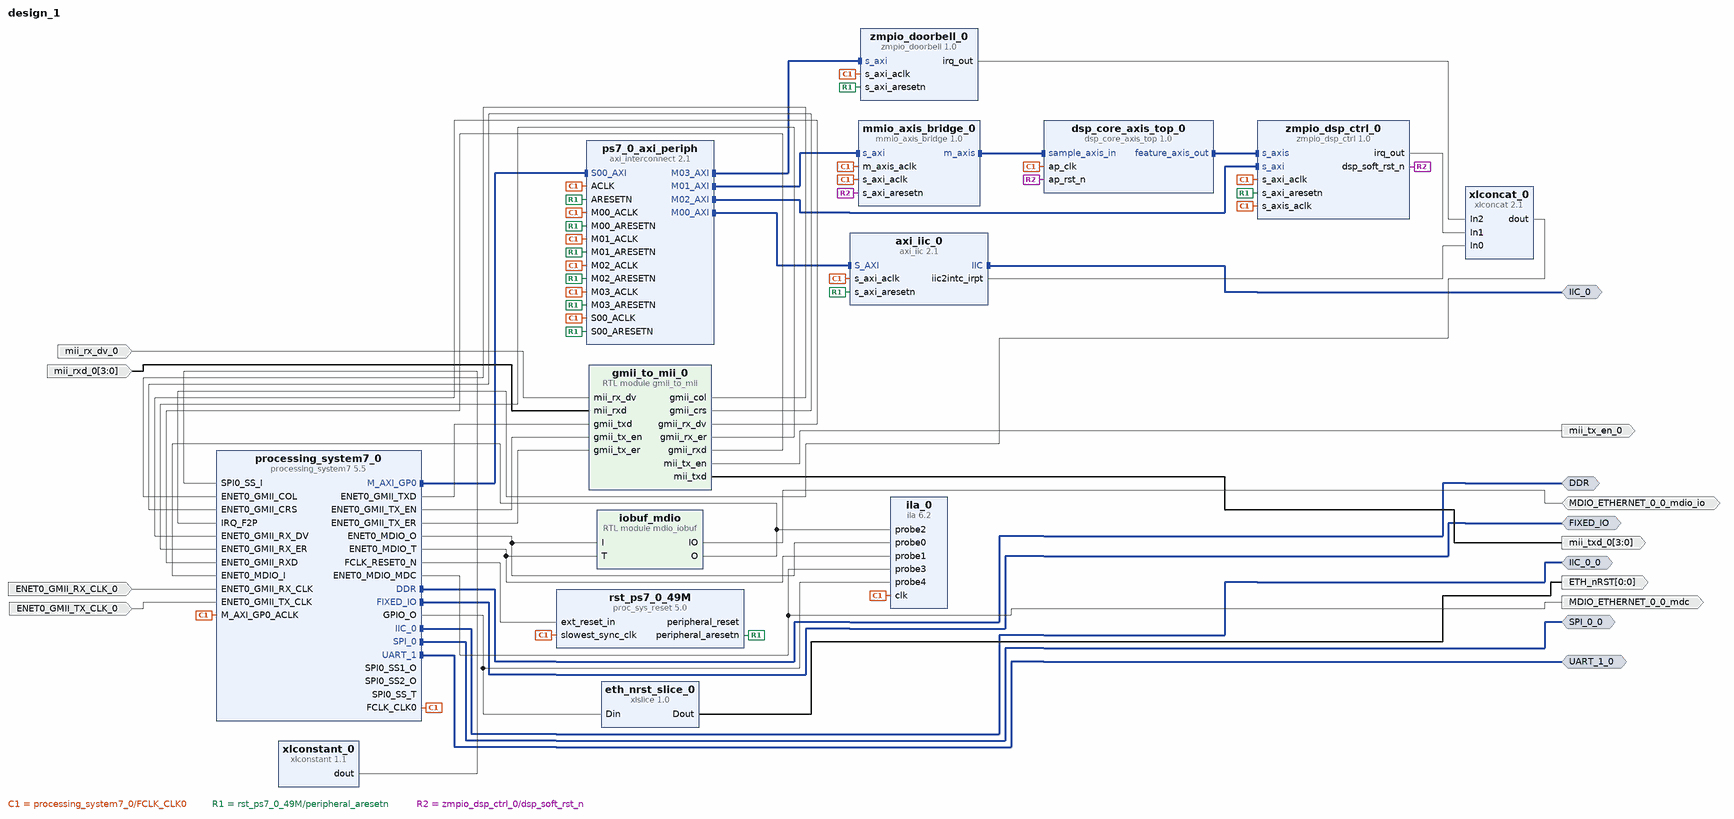
[diagram p0: block diagram of the top level]
# Vivado block design design_1, xc7z020clg400-2, Vivado 2023.2
create_bd_design design_1

create_bd_intf_port -mode Master -vlnv xilinx.com:interface:ddrx_rtl:1.0 DDR
create_bd_intf_port -mode Master -vlnv xilinx.com:display_processing_system7:fixedio_rtl:1.0 FIXED_IO
create_bd_intf_port -mode Master -vlnv xilinx.com:interface:spi_rtl:1.0 SPI_0_0
create_bd_intf_port -mode Master -vlnv xilinx.com:interface:iic_rtl:1.0 IIC_0
create_bd_intf_port -mode Master -vlnv xilinx.com:interface:iic_rtl:1.0 IIC_0_0
create_bd_intf_port -mode Master -vlnv xilinx.com:interface:uart_rtl:1.0 UART_1_0
create_bd_port -dir I -from 3 -to 0 mii_rxd_0
create_bd_port -dir I mii_rx_dv_0
create_bd_port -dir O -from 3 -to 0 mii_txd_0
create_bd_port -dir O mii_tx_en_0
create_bd_port -dir I -type clk ENET0_GMII_RX_CLK_0
create_bd_port -dir I -type clk ENET0_GMII_TX_CLK_0
create_bd_port -dir IO MDIO_ETHERNET_0_0_mdio_io
create_bd_port -dir O MDIO_ETHERNET_0_0_mdc
create_bd_port -dir O -from 0 -to 0 ETH_nRST

create_bd_cell -type ip -vlnv xilinx.com:ip:processing_system7:5.5 processing_system7_0
set_property -dict [list \
  CONFIG.PCW_APU_PERIPHERAL_FREQMHZ 533.333333 \
  CONFIG.PCW_CPU_CPU_6X4X_MAX_RANGE 767 \
  CONFIG.PCW_CRYSTAL_PERIPHERAL_FREQMHZ 33.33 \
  CONFIG.PCW_ENET0_ENET0_IO EMIO \
  CONFIG.PCW_ENET0_GRP_MDIO_ENABLE 1 \
  CONFIG.PCW_ENET0_GRP_MDIO_IO EMIO \
  CONFIG.PCW_ENET0_PERIPHERAL_ENABLE 1 \
  CONFIG.PCW_ENET0_RESET_ENABLE 0 \
  CONFIG.PCW_ENET_RESET_ENABLE 1 \
  CONFIG.PCW_ENET_RESET_SELECT {Share reset pin} \
  CONFIG.PCW_FPGA0_PERIPHERAL_FREQMHZ 50 \
  CONFIG.PCW_FPGA1_PERIPHERAL_FREQMHZ 200 \
  CONFIG.PCW_GPIO_EMIO_GPIO_ENABLE 1 \
  CONFIG.PCW_GPIO_EMIO_GPIO_IO MIO \
  CONFIG.PCW_GPIO_MIO_GPIO_ENABLE 1 \
  CONFIG.PCW_GPIO_MIO_GPIO_IO MIO \
  CONFIG.PCW_I2C0_I2C0_IO EMIO \
  CONFIG.PCW_I2C0_PERIPHERAL_ENABLE 1 \
  CONFIG.PCW_I2C_PERIPHERAL_FREQMHZ 88.879997 \
  CONFIG.PCW_I2C_RESET_ENABLE 1 \
  CONFIG.PCW_I2C_RESET_SELECT {Share reset pin} \
  CONFIG.PCW_IRQ_F2P_INTR 1 \
  CONFIG.PCW_PERIPHERAL_BOARD_PRESET None \
  CONFIG.PCW_PRESET_BANK1_VOLTAGE {LVCMOS 3.3V} \
  CONFIG.PCW_QSPI_PERIPHERAL_ENABLE 0 \
  CONFIG.PCW_SD0_GRP_CD_ENABLE 0 \
  CONFIG.PCW_SD0_GRP_WP_ENABLE 0 \
  CONFIG.PCW_SD0_PERIPHERAL_ENABLE 1 \
  CONFIG.PCW_SD0_SD0_IO {MIO 40 .. 45} \
  CONFIG.PCW_SDIO_PERIPHERAL_FREQMHZ 100 \
  CONFIG.PCW_SPI0_PERIPHERAL_ENABLE 1 \
  CONFIG.PCW_SPI0_SPI0_IO EMIO \
  CONFIG.PCW_SPI_PERIPHERAL_FREQMHZ 100 \
  CONFIG.PCW_TTC0_PERIPHERAL_ENABLE 1 \
  CONFIG.PCW_TTC0_TTC0_IO EMIO \
  CONFIG.PCW_UART0_PERIPHERAL_ENABLE 1 \
  CONFIG.PCW_UART0_UART0_IO {MIO 14 .. 15} \
  CONFIG.PCW_UART1_PERIPHERAL_ENABLE 1 \
  CONFIG.PCW_UART1_UART1_IO EMIO \
  CONFIG.PCW_UART_PERIPHERAL_FREQMHZ 100 \
  CONFIG.PCW_UIPARAM_DDR_BUS_WIDTH {16 Bit} \
  CONFIG.PCW_UIPARAM_DDR_FREQ_MHZ 533.333333 \
  CONFIG.PCW_UIPARAM_DDR_PARTNO {MT41J256M16 RE-125} \
  CONFIG.PCW_USB0_PERIPHERAL_ENABLE 0 \
  CONFIG.PCW_USB_RESET_ENABLE 1 \
  CONFIG.PCW_USE_FABRIC_INTERRUPT 1 \
  CONFIG.preset None \
] [get_bd_cells processing_system7_0]
# 516 more settings of processing_system7_0 are not shown: defaults, MIO pin electricals, DDR timing, and values the tool derives
create_bd_cell -type ip -vlnv xilinx.com:ip:axi_iic:2.1 axi_iic_0
create_bd_cell -type ip -vlnv xilinx.com:ip:axi_interconnect:2.1 ps7_0_axi_periph
set_property -dict {CONFIG.NUM_MI 4} [get_bd_cells ps7_0_axi_periph]
create_bd_cell -type ip -vlnv xilinx.com:ip:proc_sys_reset:5.0 rst_ps7_0_49M
create_bd_cell -type ip -vlnv xilinx.com:ip:xlconstant:1.1 xlconstant_0
create_bd_cell -type module -reference gmii_to_mii gmii_to_mii_0
create_bd_cell -type ip -vlnv xilinx.com:ip:ila:6.2 ila_0
set_property -dict [list \
  CONFIG.C_ADV_TRIGGER false \
  CONFIG.C_DATA_DEPTH 1024 \
  CONFIG.C_EN_STRG_QUAL 0 \
  CONFIG.C_NUM_OF_PROBES 5 \
  CONFIG.C_PROBE0_WIDTH 1 \
  CONFIG.C_PROBE1_WIDTH 1 \
  CONFIG.C_PROBE2_WIDTH 1 \
  CONFIG.C_PROBE3_WIDTH 1 \
  CONFIG.C_PROBE4_WIDTH 1 \
] [get_bd_cells ila_0]
create_bd_cell -type module -reference mdio_iobuf iobuf_mdio
create_bd_cell -type ip -vlnv zmpio:dsp_core:dsp_core_axis_top:1.0 dsp_core_axis_top_0
create_bd_cell -type ip -vlnv xilinx.com:ip:xlslice:1.0 eth_nrst_slice_0
set_property -dict {CONFIG.DIN_FROM 0 CONFIG.DIN_TO 0 CONFIG.DIN_WIDTH 64 CONFIG.DOUT_WIDTH 1} [get_bd_cells eth_nrst_slice_0]
create_bd_cell -type ip -vlnv zmpio:user:mmio_axis_bridge:1.0 mmio_axis_bridge_0
create_bd_cell -type ip -vlnv zmpio:user:zmpio_dsp_ctrl:1.0 zmpio_dsp_ctrl_0
create_bd_cell -type ip -vlnv zmpio:user:zmpio_doorbell:1.0 zmpio_doorbell_0
create_bd_cell -type ip -vlnv xilinx.com:ip:xlconcat:2.1 xlconcat_0
set_property -dict {CONFIG.NUM_PORTS 3} [get_bd_cells xlconcat_0]

# ---- connections ----

connect_bd_intf_net [get_bd_intf_ports IIC_0] [get_bd_intf_pins axi_iic_0/IIC]
connect_bd_intf_net [get_bd_intf_pins dsp_core_axis_top_0/feature_axis_out] [get_bd_intf_pins zmpio_dsp_ctrl_0/s_axis]
connect_bd_intf_net [get_bd_intf_pins mmio_axis_bridge_0/m_axis] [get_bd_intf_pins dsp_core_axis_top_0/sample_axis_in]
connect_bd_intf_net [get_bd_intf_ports DDR] [get_bd_intf_pins processing_system7_0/DDR]
connect_bd_intf_net [get_bd_intf_ports FIXED_IO] [get_bd_intf_pins processing_system7_0/FIXED_IO]
connect_bd_intf_net [get_bd_intf_ports IIC_0_0] [get_bd_intf_pins processing_system7_0/IIC_0]
connect_bd_intf_net [get_bd_intf_pins processing_system7_0/M_AXI_GP0] [get_bd_intf_pins ps7_0_axi_periph/S00_AXI]
connect_bd_intf_net [get_bd_intf_ports SPI_0_0] [get_bd_intf_pins processing_system7_0/SPI_0]
connect_bd_intf_net [get_bd_intf_ports UART_1_0] [get_bd_intf_pins processing_system7_0/UART_1]
connect_bd_intf_net [get_bd_intf_pins ps7_0_axi_periph/M00_AXI] [get_bd_intf_pins axi_iic_0/S_AXI]
connect_bd_intf_net [get_bd_intf_pins ps7_0_axi_periph/M01_AXI] [get_bd_intf_pins mmio_axis_bridge_0/s_axi]
connect_bd_intf_net [get_bd_intf_pins ps7_0_axi_periph/M02_AXI] [get_bd_intf_pins zmpio_dsp_ctrl_0/s_axi]
connect_bd_intf_net [get_bd_intf_pins ps7_0_axi_periph/M03_AXI] [get_bd_intf_pins zmpio_doorbell_0/s_axi]
connect_bd_net -net ENET0_GMII_RX_CLK_0_1 [get_bd_ports ENET0_GMII_RX_CLK_0] [get_bd_pins processing_system7_0/ENET0_GMII_RX_CLK]
connect_bd_net -net ENET0_GMII_TX_CLK_0_1 [get_bd_ports ENET0_GMII_TX_CLK_0] [get_bd_pins processing_system7_0/ENET0_GMII_TX_CLK]
# net Net has one end: 
connect_bd_net [get_bd_ports MDIO_ETHERNET_0_0_mdio_io] [get_bd_pins iobuf_mdio/IO]
connect_bd_net [get_bd_pins axi_iic_0/iic2intc_irpt] [get_bd_pins xlconcat_0/In0]
connect_bd_net [get_bd_pins eth_nrst_slice_0/Dout] [get_bd_ports ETH_nRST]
connect_bd_net [get_bd_pins gmii_to_mii_0/gmii_col] [get_bd_pins processing_system7_0/ENET0_GMII_COL]
connect_bd_net [get_bd_pins gmii_to_mii_0/gmii_crs] [get_bd_pins processing_system7_0/ENET0_GMII_CRS]
connect_bd_net [get_bd_pins gmii_to_mii_0/gmii_rx_dv] [get_bd_pins processing_system7_0/ENET0_GMII_RX_DV]
connect_bd_net [get_bd_pins gmii_to_mii_0/gmii_rx_er] [get_bd_pins processing_system7_0/ENET0_GMII_RX_ER]
connect_bd_net [get_bd_pins gmii_to_mii_0/gmii_rxd] [get_bd_pins processing_system7_0/ENET0_GMII_RXD]
connect_bd_net [get_bd_pins gmii_to_mii_0/mii_tx_en] [get_bd_ports mii_tx_en_0]
connect_bd_net [get_bd_pins gmii_to_mii_0/mii_txd] [get_bd_ports mii_txd_0]
connect_bd_net [get_bd_pins iobuf_mdio/O] [get_bd_pins processing_system7_0/ENET0_MDIO_I] [get_bd_pins ila_0/probe2]
connect_bd_net -net mii_rx_dv_0_1 [get_bd_ports mii_rx_dv_0] [get_bd_pins gmii_to_mii_0/mii_rx_dv]
connect_bd_net -net mii_rxd_0_1 [get_bd_ports mii_rxd_0] [get_bd_pins gmii_to_mii_0/mii_rxd]
connect_bd_net [get_bd_pins processing_system7_0/ENET0_GMII_TXD] [get_bd_pins gmii_to_mii_0/gmii_txd]
connect_bd_net [get_bd_pins processing_system7_0/ENET0_GMII_TX_EN] [get_bd_pins gmii_to_mii_0/gmii_tx_en]
connect_bd_net [get_bd_pins processing_system7_0/ENET0_GMII_TX_ER] [get_bd_pins gmii_to_mii_0/gmii_tx_er]
connect_bd_net -net processing_system7_0_ENET0_MDIO_MDC [get_bd_pins processing_system7_0/ENET0_MDIO_MDC] \
  [get_bd_pins ila_0/probe3] [get_bd_ports MDIO_ETHERNET_0_0_mdc]
connect_bd_net -net processing_system7_0_ENET0_MDIO_O [get_bd_pins processing_system7_0/ENET0_MDIO_O] \
  [get_bd_pins ila_0/probe0] [get_bd_pins iobuf_mdio/I]
connect_bd_net -net processing_system7_0_ENET0_MDIO_T [get_bd_pins processing_system7_0/ENET0_MDIO_T] \
  [get_bd_pins ila_0/probe1] [get_bd_pins iobuf_mdio/T]
connect_bd_net [get_bd_pins processing_system7_0/FCLK_CLK0] \
  [get_bd_pins processing_system7_0/M_AXI_GP0_ACLK] [get_bd_pins ps7_0_axi_periph/S00_ACLK] \
  [get_bd_pins rst_ps7_0_49M/slowest_sync_clk] [get_bd_pins ps7_0_axi_periph/M00_ACLK] [get_bd_pins ps7_0_axi_periph/ACLK] \
  [get_bd_pins axi_iic_0/s_axi_aclk] [get_bd_pins ila_0/clk] [get_bd_pins ps7_0_axi_periph/M01_ACLK] \
  [get_bd_pins ps7_0_axi_periph/M02_ACLK] [get_bd_pins mmio_axis_bridge_0/s_axi_aclk] \
  [get_bd_pins mmio_axis_bridge_0/m_axis_aclk] [get_bd_pins dsp_core_axis_top_0/ap_clk] \
  [get_bd_pins zmpio_dsp_ctrl_0/s_axi_aclk] [get_bd_pins zmpio_dsp_ctrl_0/s_axis_aclk] \
  [get_bd_pins zmpio_doorbell_0/s_axi_aclk] [get_bd_pins ps7_0_axi_periph/M03_ACLK]
connect_bd_net [get_bd_pins processing_system7_0/FCLK_RESET0_N] [get_bd_pins rst_ps7_0_49M/ext_reset_in]
connect_bd_net [get_bd_pins processing_system7_0/GPIO_O] [get_bd_pins eth_nrst_slice_0/Din] [get_bd_pins ila_0/probe4]
# net processing_system7_0_SPI0_SS1_O has one end: processing_system7_0/SPI0_SS1_O
# net processing_system7_0_SPI0_SS2_O has one end: processing_system7_0/SPI0_SS2_O
# net processing_system7_0_SPI0_SS_T has one end: processing_system7_0/SPI0_SS_T
connect_bd_net [get_bd_pins rst_ps7_0_49M/peripheral_aresetn] \
  [get_bd_pins ps7_0_axi_periph/S00_ARESETN] [get_bd_pins ps7_0_axi_periph/M00_ARESETN] \
  [get_bd_pins ps7_0_axi_periph/ARESETN] [get_bd_pins axi_iic_0/s_axi_aresetn] [get_bd_pins ps7_0_axi_periph/M01_ARESETN] \
  [get_bd_pins ps7_0_axi_periph/M02_ARESETN] [get_bd_pins zmpio_dsp_ctrl_0/s_axi_aresetn] \
  [get_bd_pins zmpio_doorbell_0/s_axi_aresetn] [get_bd_pins ps7_0_axi_periph/M03_ARESETN]
# net rst_ps7_0_49M_peripheral_reset has one end: rst_ps7_0_49M/peripheral_reset
connect_bd_net [get_bd_pins xlconcat_0/dout] [get_bd_pins processing_system7_0/IRQ_F2P]
connect_bd_net [get_bd_pins xlconstant_0/dout] [get_bd_pins processing_system7_0/SPI0_SS_I]
connect_bd_net [get_bd_pins zmpio_doorbell_0/irq_out] [get_bd_pins xlconcat_0/In2]
connect_bd_net [get_bd_pins zmpio_dsp_ctrl_0/dsp_soft_rst_n] [get_bd_pins dsp_core_axis_top_0/ap_rst_n] [get_bd_pins mmio_axis_bridge_0/s_axi_aresetn]
connect_bd_net [get_bd_pins zmpio_dsp_ctrl_0/irq_out] [get_bd_pins xlconcat_0/In1]
set_property HDL_ATTRIBUTE.DEBUG true [get_bd_nets Net]
set_property HDL_ATTRIBUTE.MARK_DEBUG true [get_bd_nets Net]
set_property HDL_ATTRIBUTE.DEBUG true [get_bd_nets processing_system7_0_ENET0_MDIO_MDC]
set_property HDL_ATTRIBUTE.MARK_DEBUG true [get_bd_nets processing_system7_0_ENET0_MDIO_MDC]
set_property HDL_ATTRIBUTE.DEBUG true [get_bd_nets processing_system7_0_ENET0_MDIO_O]
set_property HDL_ATTRIBUTE.MARK_DEBUG true [get_bd_nets processing_system7_0_ENET0_MDIO_O]
set_property HDL_ATTRIBUTE.DEBUG true [get_bd_nets processing_system7_0_ENET0_MDIO_T]
set_property HDL_ATTRIBUTE.MARK_DEBUG true [get_bd_nets processing_system7_0_ENET0_MDIO_T]

# ---- address map ----
assign_bd_address -offset 0x40000000 -range 4K -target_address_space [get_bd_addr_spaces processing_system7_0/Data] [get_bd_addr_segs mmio_axis_bridge_0/s_axi/reg0]
assign_bd_address -offset 0x40001000 -range 4K -target_address_space [get_bd_addr_spaces processing_system7_0/Data] [get_bd_addr_segs zmpio_dsp_ctrl_0/s_axi/reg0]
assign_bd_address -offset 0x40002000 -range 4K -target_address_space [get_bd_addr_spaces processing_system7_0/Data] [get_bd_addr_segs zmpio_doorbell_0/s_axi/reg0]
assign_bd_address -offset 0x43C00000 -range 64K -target_address_space [get_bd_addr_spaces processing_system7_0/Data] [get_bd_addr_segs axi_iic_0/S_AXI/Reg]

validate_bd_design
save_bd_design
